# Altium schematic sheet QR_Scanning1_V1_STM32.SchDoc
size 381 x 241 mm; SheetNumber: 2; SheetTotal: 3
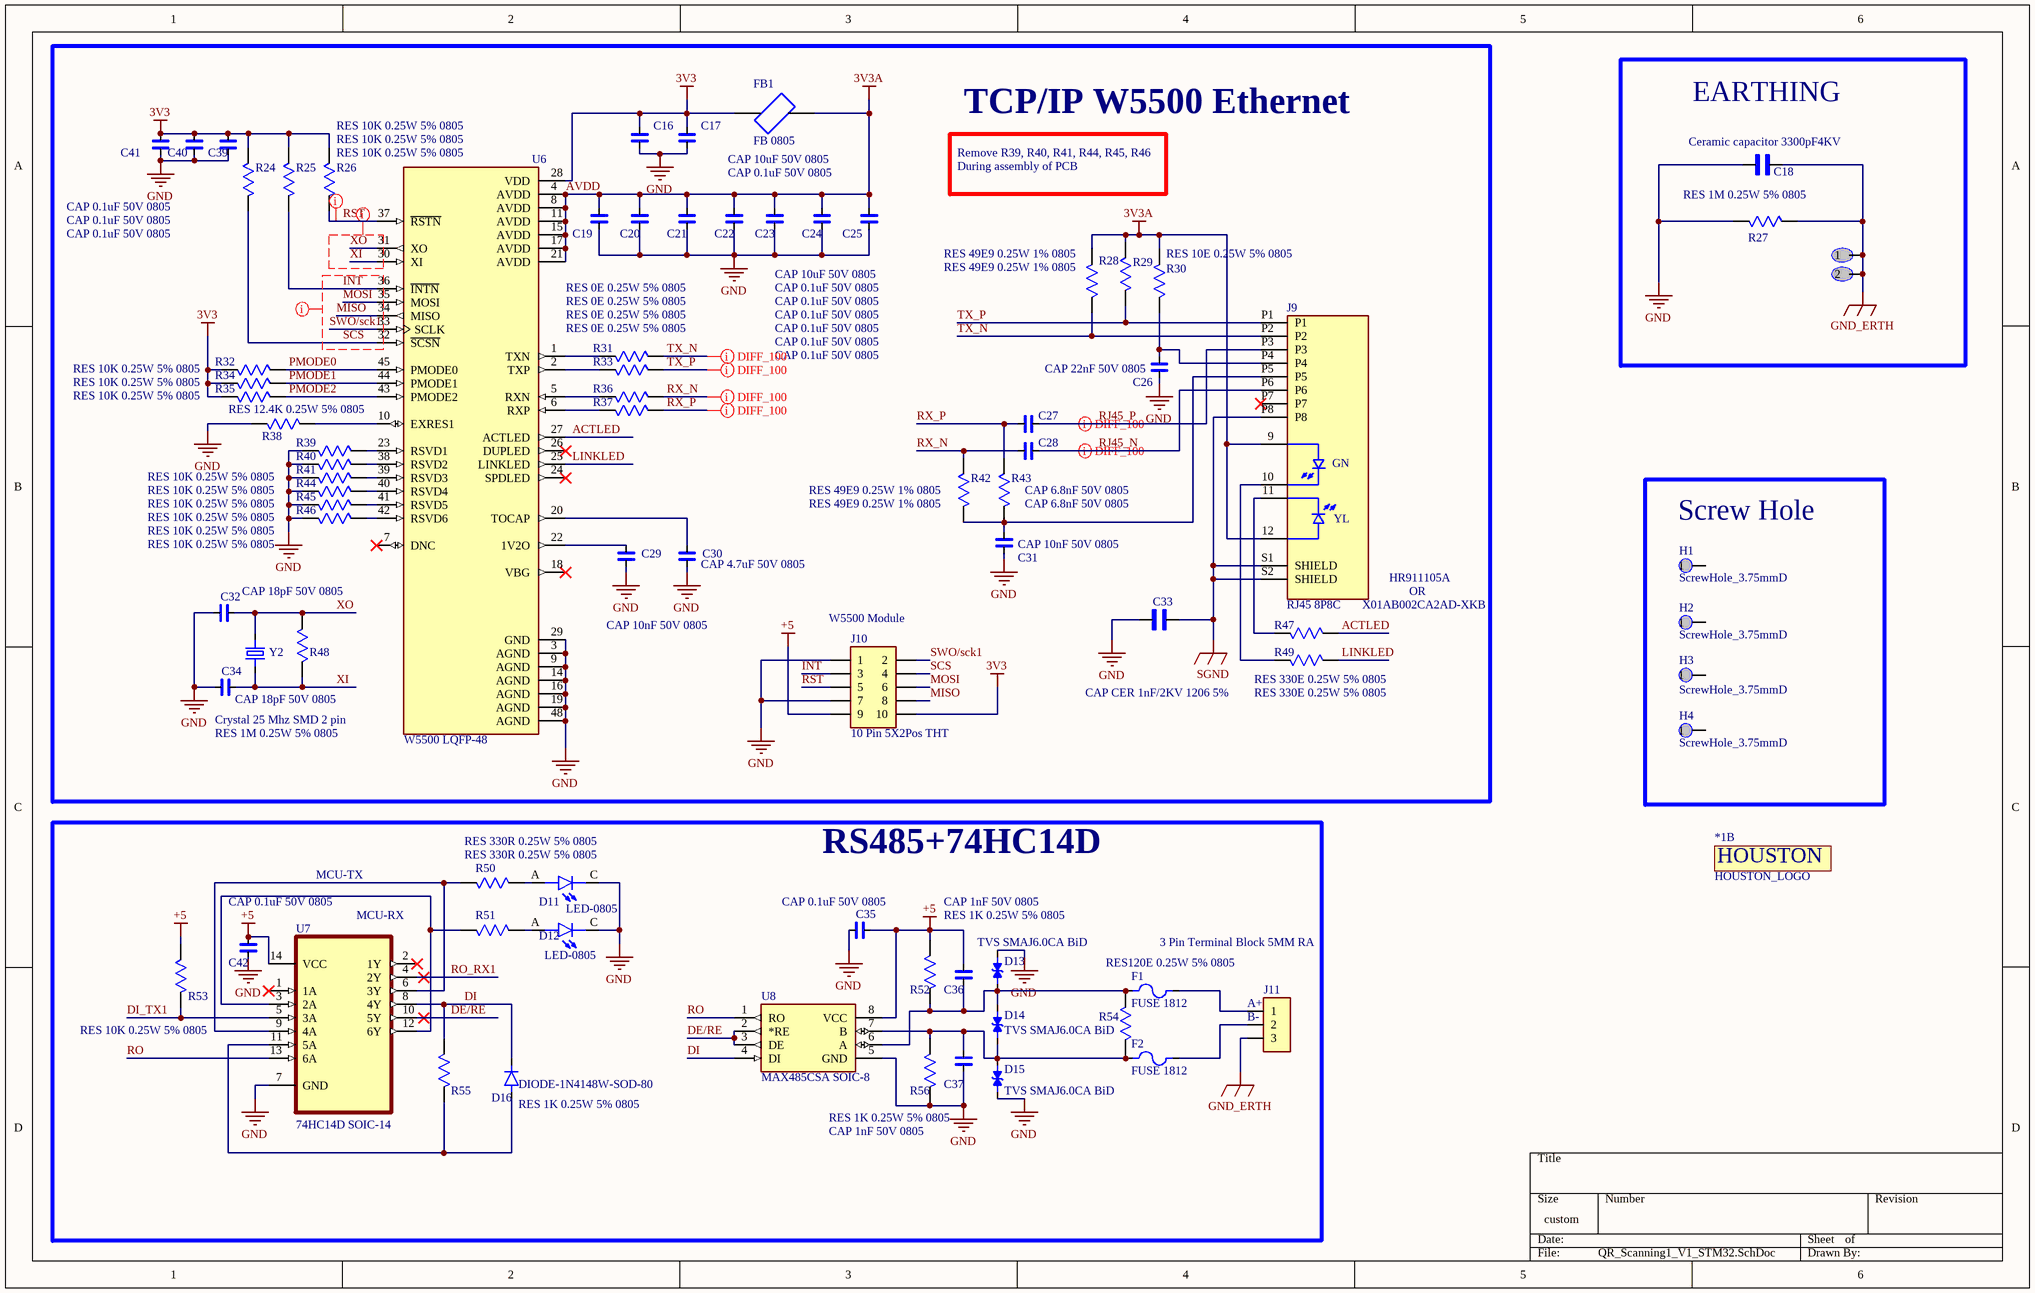
[diagram p0: QR_Scanning1_V1_STM32.SchDoc]

## Parts
*1  HOUSTON_LOGO  [HOUSTON_LOGO]  (part B of 2)
C16  CAP 0.1uF 50V 0805  [CAP CER 0.1uF/50V 5%]
C17  CAP 10uF 50V 0805  [CAP CER 0.1uF/50V 5%]
C18  Ceramic capacitor 3300pF4KV  [Ceramic capacitor 3300pF4KV]
C19  CAP 0.1uF 50V 0805  [CAP CER 0.1uF/50V 5%]
C20  CAP 0.1uF 50V 0805  [CAP CER 0.1uF/50V 5%]
C21  CAP 0.1uF 50V 0805  [CAP CER 0.1uF/50V 5%]
C22  CAP 0.1uF 50V 0805  [CAP CER 0.1uF/50V 5%]
C23  CAP 0.1uF 50V 0805  [CAP CER 0.1uF/50V 5%]
C24  CAP 0.1uF 50V 0805  [CAP CER 0.1uF/50V 5%]
C25  CAP 10uF 50V 0805  [CAP CER 0.1uF/50V 5%]
C26  CAP 22nF 50V 0805  [CAP CER 0.1uF/50V 5%]
C27  CAP 6.8nF 50V 0805  [CAP CER 0.1uF/50V 5%]
C28  CAP 6.8nF 50V 0805  [CAP CER 0.1uF/50V 5%]
C29  CAP 10nF 50V 0805  [CAP CER 0.1uF/50V 5%]
C30  CAP 4.7uF 50V 0805  [CAP CER 0.1uF/50V 5%]
C31  CAP 10nF 50V 0805  [CAP CER 0.1uF/50V 5%]
C32  CAP 18pF 50V 0805  [CAP CER 0.1uF/50V 5%]
C33  CAP CER 1nF/2KV 1206 5%  [CAP CER 1nF/2KV 1206 5%]
C34  CAP 18pF 50V 0805  [CAP CER 0.1uF/50V 5%]
C35  CAP 0.1uF 50V 0805  [CAP CER 0.1uF/50V 5%]
C36  CAP 1nF 50V 0805  [CAP CER 0.1uF/50V 5%]
C37  CAP 1nF 50V 0805  [CAP CER 0.1uF/50V 5%]
C39  CAP 0.1uF 50V 0805  [CAP CER 0.1uF/50V 5%]
C40  CAP 0.1uF 50V 0805  [CAP CER 0.1uF/50V 5%]
C41  CAP 0.1uF 50V 0805  [CAP CER 0.1uF/50V 5%]
C42  CAP 0.1uF 50V 0805  [CAP CER 0.1uF/50V 5%]
D11  LED-0805  [LED-0805]
D12  LED-0805  [LED-0805]
D13  TVS SMAJ6.0CA BiD  [TVS SMAJ6.0CA DO-214AC (SMA)]
D14  TVS SMAJ6.0CA BiD  [TVS SMAJ6.0CA DO-214AC (SMA)]
D15  TVS SMAJ6.0CA BiD  [TVS SMAJ6.0CA DO-214AC (SMA)]
D16  DIODE-1N4148W-SOD-80  [DIODE-1N4148W-SOD-80]
EARTHING_VIA_HOLE_3.65MM  EARTHING_VIA HOLE_3.65MM  [EARTHING_VIA HOLE_3.65MM]  (value not drawn)
F1  FUSE 1812  [FUSE 1812]
F2  FUSE 1812  [FUSE 1812]
FB1  FB 0805  [FB 0805]
H1  ScrewHole_3.75mmD  [ScrewHole_3.75mmD - duplicate]
H2  ScrewHole_3.75mmD  [ScrewHole_3.75mmD - duplicate]
H3  ScrewHole_3.75mmD  [ScrewHole_3.75mmD - duplicate]
H4  ScrewHole_3.75mmD  [ScrewHole_3.75mmD - duplicate]
J9  RJ45 8P8C  [RJ45 8P8C]
J10  10 Pin 5X2Pos THT  [10 Pin 5X2Pos THT]
J11  3 Pin Terminal Block 5MM RA  [3 Pin Terminal Block 5MM RA]
R24  RES 10K 0.25W 5% 0805  [RES 0805 10K/0.25W 5%]
R25  RES 10K 0.25W 5% 0805  [RES 0805 10K/0.25W 5%]
R26  RES 10K 0.25W 5% 0805  [RES 0805 10K/0.25W 5%]
R27  RES 1M 0.25W 5% 0805  [RES 0805 10K/0.25W 5%]
R28  RES 49E9 0.25W 1% 0805  [RES 0805 10K/0.25W 5%]
R29  RES 49E9 0.25W 1% 0805  [RES 0805 10K/0.25W 5%]
R30  RES 10E 0.25W 5% 0805  [RES 0805 10K/0.25W 5%]
R31  RES 0E 0.25W 5% 0805  [RES 0805 10K/0.25W 5%]
R32  RES 10K 0.25W 5% 0805  [RES 0805 10K/0.25W 5%]
R33  RES 0E 0.25W 5% 0805  [RES 0805 10K/0.25W 5%]
R34  RES 10K 0.25W 5% 0805  [RES 0805 10K/0.25W 5%]
R35  RES 10K 0.25W 5% 0805  [RES 0805 10K/0.25W 5%]
R36  RES 0E 0.25W 5% 0805  [RES 0805 10K/0.25W 5%]
R37  RES 0E 0.25W 5% 0805  [RES 0805 10K/0.25W 5%]
R38  RES 12.4K 0.25W 5% 0805  [RES 0805 10K/0.25W 5%]
R39  RES 10K 0.25W 5% 0805  [RES 0805 10K/0.25W 5%]
R40  RES 10K 0.25W 5% 0805  [RES 0805 10K/0.25W 5%]
R41  RES 10K 0.25W 5% 0805  [RES 0805 10K/0.25W 5%]
R42  RES 49E9 0.25W 1% 0805  [RES 0805 10K/0.25W 5%]
R43  RES 49E9 0.25W 1% 0805  [RES 0805 10K/0.25W 5%]
R44  RES 10K 0.25W 5% 0805  [RES 0805 10K/0.25W 5%]
R45  RES 10K 0.25W 5% 0805  [RES 0805 10K/0.25W 5%]
R46  RES 10K 0.25W 5% 0805  [RES 0805 10K/0.25W 5%]
R47  RES 330E 0.25W 5% 0805  [RES 0805 10K/0.25W 5%]
R48  RES 1M 0.25W 5% 0805  [RES 0805 10K/0.25W 5%]
R49  RES 330E 0.25W 5% 0805  [RES 0805 10K/0.25W 5%]
R50  RES 330R 0.25W 5% 0805  [RES 0805 10K/0.25W 5%]
R51  RES 330R 0.25W 5% 0805  [RES 0805 10K/0.25W 5%]
R52  RES 1K 0.25W 5% 0805  [RES 0805 10K/0.25W 5%]
R53  RES 10K 0.25W 5% 0805  [RES 0805 10K/0.25W 5%]
R54  RES120E 0.25W 5% 0805  [RES 0805 10K/0.25W 5%]
R55  RES 1K 0.25W 5% 0805  [RES 0805 10K/0.25W 5%]
R56  RES 1K 0.25W 5% 0805  [RES 0805 10K/0.25W 5%]
U6  W5500 LQFP-48  [W5500 LQFP-48]
U7  74HC14D SOIC-14  [74HC14D SOIC-14]
U8  MAX485CSA SOIC-8  [MAX485CSA]
Y2  Crystal 25 Mhz SMD 2 pin  [Crystal 16 Mhz SMD 2 pin]

## Blocks framed on the sheet
TCP/IP W5500 Ethernet: C16 C17 C19-C34 C39-C41 FB1 J9 J10 R24-R26 R28-R49 U6 Y2
EARTHING: C18 EARTHING_VIA_HOLE_3.65MM R27
Screw Hole: H1-H4
RS485+74HC14D: C35-C37 C42 D11-D16 F1 F2 J11 R50-R56 U7 U8

## Nets
3V3: C16.2 C17.2 C39.2 C40.2 C41.2 FB1.1 J10.10 R24.2 R25.2 R26.2 R32.2 R34.2 R35.2 U6.28(VDD)
+5: C35.1 C36.2 C42.2 J10.9 R52.1 R53.2 U7.14(VCC) U8.8(VCC)
AVDD: C19.2 C20.2 C21.2 C22.2 C23.2 C24.2 C25.2 FB1.2 J9.9 J9.12 R28.2 R29.2 R30.2 U6.4(AVDD) U6.8(AVDD) U6.11(AVDD) U6.15(AVDD) U6.17(AVDD) U6.21(AVDD)  [also labelled 3V3A]
GND: C16.1 C17.1 C18.1 C19.1 C20.1 C21.1 C22.1 C23.1 C24.1 C25.1 C26.1 C29.1 C30.1 C31.1 C32.2 C33.1 C34.2 C35.2 C37.2 C39.1 C40.1 C41.1 C42.1 D11.C D12.C D13.2 D15.1 J10.1 J10.7 R27.1 R38.1 R39.2 R40.2 R41.2 R44.2 R45.2 R46.2 R56.1 U6.3(AGND) U6.9(AGND) U6.14(AGND) U6.16(AGND) U6.19(AGND) U6.29(GND) U6.48(AGND) U7.7(GND) U8.5(GND)
GND_ERTH: C18.2 EARTHING_VIA_HOLE_3.65MM.1 EARTHING_VIA_HOLE_3.65MM.2 J11.3 R27.2
SGND: C33.2 J9.P8 J9.S1(SHIELD) J9.S2(SHIELD)
ACTLED: R47.1 U6.27(ACTLED)
DE/RE: U7.10(5Y) U8.2(*RE) U8.3(DE)
DI: D16.C(K) R55.2 U7.8(4Y) U8.4(DI)
DI_TX1: R53.1 U7.5(3A)
INT: J10.3 R25.1 U6.36(~{INTN})
LINKLED: R49.1 U6.25(LINKLED)
MISO: J10.8 U6.34(MISO)
MOSI: J10.6 U6.35(MOSI)
PMODE0: R32.1 U6.45(PMODE0)
PMODE1: R34.1 U6.44(PMODE1)
PMODE2: R35.1 U6.43(PMODE2)
RJ45_N: C28.1 J9.P6
RJ45_P: C27.1 J9.P3
RO: U7.13(6A) U8.1(RO)
RO_RX1: U7.4(2Y)
RST: J10.5 R26.1 U6.37(~{RSTN})
RX_N: C28.2 R36.1 R42.2
RX_P: C27.2 R37.1 R43.2
SCS: J10.4 R24.1 U6.32(~{SCSN})
SWO/sck1: J10.2 U6.33(SCLK)
TX_N: J9.P2 R28.1 R31.1
TX_P: J9.P1 R29.1 R33.1
XI: C34.1 R48.1 U6.30(XI) Y2.2
XO: C32.1 R48.2 U6.31(XO) Y2.1
NetC26_2: C26.2 J9.P4 R30.1
NetC29_2: C29.2 U6.22(1V2O)
NetC30_2: C30.2 U6.20(TOCAP)
NetC31_2: C31.2 J9.P5 R42.1 R43.1
NetC36_1: C36.1 D13.1 D14.2 F1.1 R52.2 R54.2 U8.6(A)
NetC37_1: C37.1 D14.1 D15.2 F2.1 R54.1 R56.2 U8.7(B)
NetD11_A: D11.A R50.1
NetD12_A: D12.A R51.1
NetD16_A: D16.A R55.1 U7.11(5A)
NetF1_2: F1.2 J11.1
NetF2_2: F2.2 J11.2
NetJ9_10: J9.10 R49.2
NetJ9_11: J9.11 R47.2
NetR31_2: R31.2 U6.1(TXN)
NetR33_2: R33.2 U6.2(TXP)
NetR36_2: R36.2 U6.5(RXN)
NetR37_2: R37.2 U6.6(RXP)
NetR38_2: R38.2 U6.10(EXRES1)
NetR39_1: R39.1 U6.23(RSVD1)
NetR40_1: R40.1 U6.38(RSVD2)
NetR41_1: R41.1 U6.39(RSVD3)
NetR44_1: R44.1 U6.40(RSVD4)
NetR45_1: R45.1 U6.41(RSVD5)
NetR46_1: R46.1 U6.42(RSVD6)
NetR50_2: R50.2 U7.6(3Y) U7.9(4A)
NetR51_2: R51.2 U7.3(2A) U7.12(6Y)

Not connected (* = marked no-connect by the designer): H1 1; H2 1; H3 1; H4 1; J9 P7*; U6 7(DNC)* 18(VBG)* 24(SPDLED)* 26(DUPLED)*; U7 1(1A)* 2(1Y)*

## Layout directives
net class Single_50 ohm: INT, MISO, MOSI, RST, SCS, SWO/sck1, XI, XO
differential pair; differential pair class DIFF_100: RJ45_N, RJ45_P, RX_N, RX_P, TX_N, TX_P

## Notes on the sheet
- Remove R39, R40, R41, R44, R45, R46
- During assembly of PCB
- (near J10) W5500 Module
- X01AB002CA2AD-XKB
- HR911105A
- OR
- MCU-TX
- (near U7) MCU-RX
- (near J11) B-
- (near J11) A+
- (in symbol HOUSTON_LOGO, part B) HOUSTON
- (in symbol RJ45 8P8C) GN; YL

## Library data of the parts
C16 C17 C19-C32 C34-C37 C39-C42 = CAP CER 0.1uF/50V 5%: CAP CER 0.1uF/50V  Ceramic Capacitor X7R 0805 (2012 Metric) SMT; MF: Samsung; MP: CL21B104KCFNNNE; Purchase-URL: https://pricing.snapeda.com/search?q=CL21B104KCFNNNE&ref=eda; Package: 0805 Samsung; Check_prices: https://www.snapeda.com/parts/CL21B104KCFNNNE/Samsung+Electro-Mechanics/view-part/?ref=eda; Value: *; SnapEDA_Link: https://www.snapeda.com/parts/CL21B104KCFNNNE/Samsung+Electro-Mechanics/view-part/?ref=snap; Digi-Key_Part_Number: 1276-6840-2-ND
C18 = Ceramic capacitor 3300pF4KV: Ceramic capacitor 3300pF4KV, Tension nominale 400Vac(r.m.s.), 4KV ESD, DE2E3SA332MA3BY02F; MF: Murata; Package: NONSTANDARD; Value: *; Purchase-URL: https://pricing.snapeda.com/search/part/DE2E3SA332MA3BY02F/?ref=eda; Availability: Bad; SnapEDA_Link: https://www.snapeda.com/parts/DE2E3SA332MA3BY02F/Murata/view-part/2799752/?ref=snap; Price: None; MP: DE2E3SA332MA3BY02F; Check_prices: https://www.snapeda.com/parts/DE2E3SA332MA3BY02F/Murata/view-part/2799752/?ref=eda
C33 = CAP CER 1nF/2KV 1206 5%: 1000 pF Â±10% 2000V (2kV) Ceramic Capacitor X7R 1206 (3216 Metric) C1206C102KGRACAUTO; MF: KEMET; SnapEDA_Link: https://www.snapeda.com/parts/C1206C102KGRACAUTO/KEMET/view-part/?ref=snap; Package: 3216 KEMET; Value: *; MP: C1206C102KGRACAUTO; Check_prices: https://www.snapeda.com/parts/C1206C102KGRACAUTO/KEMET/view-part/?ref=eda
D11 D12 = LED-0805: Red 640nm LED Indication - Discrete 1.85V 0805 (2012 Metric) APT2012SRCPRV; MF: Kingbright; SnapEDA_Link: https://www.snapeda.com/parts/APT2012SRCPRV/Kingbright/view-part/?ref=snap; Package: 0805 Kingbright; Value: *; MP: APT2012SRCPRV; Check_prices: https://www.snapeda.com/parts/APT2012SRCPRV/Kingbright/view-part/?ref=eda
D13-D15 = TVS SMAJ6.0CA DO-214AC (SMA): SMAJ6.0CA WG Bidirectional TVS diode littlefuse DO-214AC (SMA); MP: SMAJ7.5CA; Availability: Unavailable; Package: None; Value: *; Price: None
D16 = DIODE-1N4148W-SOD-80: DIODE-1N4148W-SOD-80 is a general-purpose silicon diode LL4148_L1G; MP: LL4148_L1G; Price: None; Package: None; Availability: Unavailable; Value: *
F1 F2 = FUSE 1812: Polymeric PTC Resettable Fuse 60V 100 mA Ih Surface Mount 1812 (4532 Metric), Concave, MF-MSMF010-2; MF: Bourns; Price: None; Availability: In Stock; MP: MF-MSMF010-2; Package: 1812 Bourns; SnapEDA_Link: https://www.snapeda.com/parts/MF-MSMF010-2/Bourns/view-part/?ref=snap; Check_prices: https://www.snapeda.com/parts/MF-MSMF010-2/Bourns/view-part/?ref=eda; Value: *; Purchase-URL: https://pricing.snapeda.com/search/part/MF-MSMF010-2/?ref=eda
FB1 = FB 0805: MH2029-101Y-Bourns Inc.-Ferrite Bead, 100 Ohms @ 100 MHz , Signal Line Ferrite Bead 0805 (2012 Metric) 2A 100mOhm; MP: MPZ2012S102AT000; Package: None; Price: None; Value: *; Availability: Unavailable
H1-H4 = ScrewHole_3.75mmD: SCREW HEAD DIA 4.5MM, SREW LEG DIA 3 MM
J9 = RJ45 8P8C: 10/100 BaseT, 8P8C, Horizontal, Shielded, LED, Through Hole, 6 Âµin Plating, RJ45 with Integrated Magnetics Modular Connector CRJ011-ML1-TH; MF: Same Sky; SnapEDA_Link: https://www.snapeda.com/parts/CRJ011-ML1-TH/Same+Sky/view-part/?ref=snap; Package: None; Value: *; MP: CRJ011-ML1-TH; Check_prices: https://www.snapeda.com/parts/CRJ011-ML1-TH/Same+Sky/view-part/?ref=eda
J10 = 10 Pin 5X2Pos THT: 10 Pin 5X2Pos THT BergeStick 2.54MM MTSW-105-X-X-D-X; MF: {'manufacturer': u'Samtec Inc.'}; Package: None; Price: None; Value: *; MP: MTSW-105-X-X-D-X; Availability: Unavailable
J11 = 3 Pin Terminal Block 5MM RA: 3 Pin Terminal Block HDR 5MM THT RA 231-433_001-000; MP: 231-433/001-000; MF: WAGO; SnapEDA_Link: https://www.snapeda.com/parts/231-433/001-000/WAGO/view-part/482062/?ref=snap; Package: None; Availability: Unavailable; Price: None; Value: *
R24-R26 R28-R56 = RES 10K 0.25W 5% 0805: RESISTOR, THICK FILM, 10K, 5%, 0805 0.25W SMT; MP: ERJ-6GEYJ103V; MF: Panasonic Electronic; Price: None; Check_prices: https://www.snapeda.com/parts/ERJ-6GEYJ103V/Panasonic+Electronic+Components/view-part/?ref=eda; Package: 805-2 Panasonic; Purchase-URL: https://pricing.snapeda.com/search/part/ERJ-6GEYJ103V/?ref=eda; Availability: In Stock; SnapEDA_Link: https://www.snapeda.com/parts/ERJ-6GEYJ103V/Panasonic+Electronic+Components/view-part/?ref=snap; Value: *
R27 = RES 10K 0.25W 5% 0805: RESISTOR, THICK FILM, 1M, 5%, 0805 0.25W SMT; MP: ERJ-6GEYJ103V; MF: Panasonic Electronic; Price: None; Check_prices: https://www.snapeda.com/parts/ERJ-6GEYJ103V/Panasonic+Electronic+Components/view-part/?ref=eda; Package: 805-2 Panasonic; Purchase-URL: https://pricing.snapeda.com/search/part/ERJ-6GEYJ103V/?ref=eda; Availability: In Stock; SnapEDA_Link: https://www.snapeda.com/parts/ERJ-6GEYJ103V/Panasonic+Electronic+Components/view-part/?ref=snap; Value: *
U6 = W5500: W5500 LQFP-48 Hardwired TCP/IP embedded Ethernet controller; Availability: Unavailable; MP: W5500; Value: *; Price: None; Package: None
U7 = 74HC14D,653: Inverter IC 6 Channel Schmitt Trigger 14-SO/SOIC-14; MF: Nexperia USA; SnapEDA_Link: https://www.snapeda.com/parts/74HC14D,653/Nexperia/view-part/?ref=snap; Package: SO14-14 Nexperia USA Inc.; Value: *; MP: 74HC14D,653; Check_prices: https://www.snapeda.com/parts/74HC14D,653/Nexperia/view-part/?ref=eda
U8 = MAX485CSA: MAX485CSA-RS-485/RS-422 Transceivers, SOIC-8; MF: Analog Devices; MP: MAX485CSA+; SnapEDA_Link: https://www.snapeda.com/parts/MAX485CSA+/Analog+Devices/view-part/?ref=snap; Package: SOIC-8 Maxim; Value: *; Check_prices: https://www.snapeda.com/parts/MAX485CSA+/Analog+Devices/view-part/?ref=eda
Y2 = Crystal 16 Mhz SMD 2 pin_1: 16 MHz Â±30ppm Crystal 20pF 60 Ohms HC-49/US FOXSDLF/128-20 16 Mhz Crystal SMD –CSM-4ALX(28ALX) 12.5mmX4.85mmX4mm; MF: Fox Electronics; SnapEDA_Link: https://www.snapeda.com/parts/FOXSDLF/128-20/Fox+Electronics/view-part/?ref=snap; Package: HC49SD Fox Electronics; Value: *; MP: FOXSDLF/128-20; Check_prices: https://www.snapeda.com/parts/FOXSDLF/128-20/Fox+Electronics/view-part/?ref=eda